# Altium schematic sheet Sheet1.SchDoc
size A4
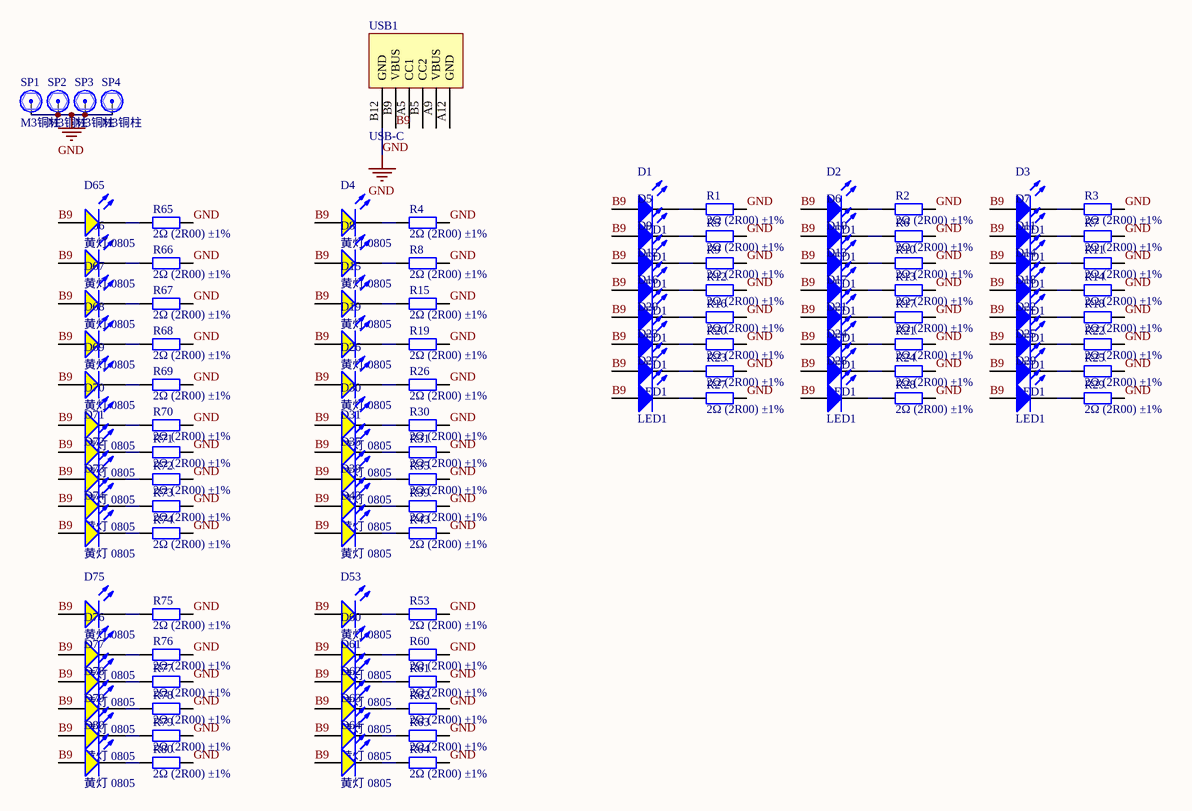
[diagram p0: Sheet1.SchDoc]

## Parts
D1  LED1  [LED-1]
D2  LED1  [LED-1]
D3  LED1  [LED-1]
D4  黄灯 0805  [0805_LED_S1]
D5  LED1  [LED-1]
D6  LED1  [LED-1]
D7  LED1  [LED-1]
D8  黄灯 0805  [0805_LED_S1]
D9  LED1  [LED-1]
D10  LED1  [LED-1]
D11  LED1  [LED-1]
D12  LED1  [LED-1]
D13  LED1  [LED-1]
D14  LED1  [LED-1]
D15  黄灯 0805  [0805_LED_S1]
D16  LED1  [LED-1]
D17  LED1  [LED-1]
D18  LED1  [LED-1]
D19  黄灯 0805  [0805_LED_S1]
D20  LED1  [LED-1]
D21  LED1  [LED-1]
D22  LED1  [LED-1]
D23  LED1  [LED-1]
D24  LED1  [LED-1]
D25  LED1  [LED-1]
D26  黄灯 0805  [0805_LED_S1]
D27  LED1  [LED-1]
D28  LED1  [LED-1]
D29  LED1  [LED-1]
D30  黄灯 0805  [0805_LED_S1]
D31  黄灯 0805  [0805_LED_S1]
D35  黄灯 0805  [0805_LED_S1]
D39  黄灯 0805  [0805_LED_S1]
D43  黄灯 0805  [0805_LED_S1]
D53  黄灯 0805  [0805_LED_S1]
D60  黄灯 0805  [0805_LED_S1]
D61  黄灯 0805  [0805_LED_S1]
D62  黄灯 0805  [0805_LED_S1]
D63  黄灯 0805  [0805_LED_S1]
D64  黄灯 0805  [0805_LED_S1]
D65  黄灯 0805  [0805_LED_S1]
D66  黄灯 0805  [0805_LED_S1]
D67  黄灯 0805  [0805_LED_S1]
D68  黄灯 0805  [0805_LED_S1]
D69  黄灯 0805  [0805_LED_S1]
D70  黄灯 0805  [0805_LED_S1]
D71  黄灯 0805  [0805_LED_S1]
D72  黄灯 0805  [0805_LED_S1]
D73  黄灯 0805  [0805_LED_S1]
D74  黄灯 0805  [0805_LED_S1]
D75  黄灯 0805  [0805_LED_S1]
D76  黄灯 0805  [0805_LED_S1]
D77  黄灯 0805  [0805_LED_S1]
D78  黄灯 0805  [0805_LED_S1]
D79  黄灯 0805  [0805_LED_S1]
D80  黄灯 0805  [0805_LED_S1]
R1  2Ω (2R00) ±1%  [0805_R]
R2  2Ω (2R00) ±1%  [0805_R]
R3  2Ω (2R00) ±1%  [0805_R]
R4  2Ω (2R00) ±1%  [0805_R]
R5  2Ω (2R00) ±1%  [0805_R]
R6  2Ω (2R00) ±1%  [0805_R]
R7  2Ω (2R00) ±1%  [0805_R]
R8  2Ω (2R00) ±1%  [0805_R]
R9  2Ω (2R00) ±1%  [0805_R]
R10  2Ω (2R00) ±1%  [0805_R]
R11  2Ω (2R00) ±1%  [0805_R]
R12  2Ω (2R00) ±1%  [0805_R]
R13  2Ω (2R00) ±1%  [0805_R]
R14  2Ω (2R00) ±1%  [0805_R]
R15  2Ω (2R00) ±1%  [0805_R]
R16  2Ω (2R00) ±1%  [0805_R]
R17  2Ω (2R00) ±1%  [0805_R]
R18  2Ω (2R00) ±1%  [0805_R]
R19  2Ω (2R00) ±1%  [0805_R]
R20  2Ω (2R00) ±1%  [0805_R]
R21  2Ω (2R00) ±1%  [0805_R]
R22  2Ω (2R00) ±1%  [0805_R]
R23  2Ω (2R00) ±1%  [0805_R]
R24  2Ω (2R00) ±1%  [0805_R]
R25  2Ω (2R00) ±1%  [0805_R]
R26  2Ω (2R00) ±1%  [0805_R]
R27  2Ω (2R00) ±1%  [0805_R]
R28  2Ω (2R00) ±1%  [0805_R]
R29  2Ω (2R00) ±1%  [0805_R]
R30  2Ω (2R00) ±1%  [0805_R]
R31  2Ω (2R00) ±1%  [0805_R]
R35  2Ω (2R00) ±1%  [0805_R]
R39  2Ω (2R00) ±1%  [0805_R]
R43  2Ω (2R00) ±1%  [0805_R]
R53  2Ω (2R00) ±1%  [0805_R]
R60  2Ω (2R00) ±1%  [0805_R]
R61  2Ω (2R00) ±1%  [0805_R]
R62  2Ω (2R00) ±1%  [0805_R]
R63  2Ω (2R00) ±1%  [0805_R]
R64  2Ω (2R00) ±1%  [0805_R]
R65  2Ω (2R00) ±1%  [0805_R]
R66  2Ω (2R00) ±1%  [0805_R]
R67  2Ω (2R00) ±1%  [0805_R]
R68  2Ω (2R00) ±1%  [0805_R]
R69  2Ω (2R00) ±1%  [0805_R]
R70  2Ω (2R00) ±1%  [0805_R]
R71  2Ω (2R00) ±1%  [0805_R]
R72  2Ω (2R00) ±1%  [0805_R]
R73  2Ω (2R00) ±1%  [0805_R]
R74  2Ω (2R00) ±1%  [0805_R]
R75  2Ω (2R00) ±1%  [0805_R]
R76  2Ω (2R00) ±1%  [0805_R]
R77  2Ω (2R00) ±1%  [0805_R]
R78  2Ω (2R00) ±1%  [0805_R]
R79  2Ω (2R00) ±1%  [0805_R]
R80  2Ω (2R00) ±1%  [0805_R]
SP1  M3铜柱  [M3x4_L]
SP2  M3铜柱  [M3x4_L]
SP3  M3铜柱  [M3x4_L]
SP4  M3铜柱  [M3x4_L]
USB1  USB-C  [USB-C/S_C]

## Nets
GND: R1.2 R2.2 R3.2 R4.2 R5.2 R6.2 R7.2 R8.2 R9.2 R10.2 R11.2 R12.2 R13.2 R14.2 R15.2 R16.2 R17.2 R18.2 R19.2 R20.2 R21.2 R22.2 R23.2 R24.2 R25.2 R26.2 R27.2 R28.2 R29.2 R30.2 R31.2 R35.2 R39.2 R43.2 R53.2 R60.2 R61.2 R62.2 R63.2 R64.2 R65.2 R66.2 R67.2 R68.2 R69.2 R70.2 R71.2 R72.2 R73.2 R74.2 R75.2 R76.2 R77.2 R78.2 R79.2 R80.2 SP1.1 SP2.1 SP3.1 SP4.1 USB1.B12(GND)
B9: D1.1(A) D2.1(A) D3.1(A) D4.A D5.1(A) D6.1(A) D7.1(A) D8.A D9.1(A) D10.1(A) D11.1(A) D12.1(A) D13.1(A) D14.1(A) D15.A D16.1(A) D17.1(A) D18.1(A) D19.A D20.1(A) D21.1(A) D22.1(A) D23.1(A) D24.1(A) D25.1(A) D26.A D27.1(A) D28.1(A) D29.1(A) D30.A D31.A D35.A D39.A D43.A D53.A D60.A D61.A D62.A D63.A D64.A D65.A D66.A D67.A D68.A D69.A D70.A D71.A D72.A D73.A D74.A D75.A D76.A D77.A D78.A D79.A D80.A USB1.B9(VBUS)
NetD1_2: D1.2(K) R1.1
NetD2_2: D2.2(K) R2.1
NetD3_2: D3.2(K) R3.1
NetD4_K: D4.K R4.1
NetD5_2: D5.2(K) R5.1
NetD6_2: D6.2(K) R6.1
NetD7_2: D7.2(K) R7.1
NetD8_K: D8.K R8.1
NetD9_2: D9.2(K) R9.1
NetD10_2: D10.2(K) R10.1
NetD11_2: D11.2(K) R11.1
NetD12_2: D12.2(K) R12.1
NetD13_2: D13.2(K) R13.1
NetD14_2: D14.2(K) R14.1
NetD15_K: D15.K R15.1
NetD16_2: D16.2(K) R16.1
NetD17_2: D17.2(K) R17.1
NetD18_2: D18.2(K) R18.1
NetD19_K: D19.K R19.1
NetD20_2: D20.2(K) R20.1
NetD21_2: D21.2(K) R21.1
NetD22_2: D22.2(K) R22.1
NetD23_2: D23.2(K) R23.1
NetD24_2: D24.2(K) R24.1
NetD25_2: D25.2(K) R25.1
NetD26_K: D26.K R26.1
NetD27_2: D27.2(K) R27.1
NetD28_2: D28.2(K) R28.1
NetD29_2: D29.2(K) R29.1
NetD30_K: D30.K R30.1
NetD31_K: D31.K R31.1
NetD35_K: D35.K R35.1
NetD39_K: D39.K R39.1
NetD43_K: D43.K R43.1
NetD53_K: D53.K R53.1
NetD60_K: D60.K R60.1
NetD61_K: D61.K R61.1
NetD62_K: D62.K R62.1
NetD63_K: D63.K R63.1
NetD64_K: D64.K R64.1
NetD65_K: D65.K R65.1
NetD66_K: D66.K R66.1
NetD67_K: D67.K R67.1
NetD68_K: D68.K R68.1
NetD69_K: D69.K R69.1
NetD70_K: D70.K R70.1
NetD71_K: D71.K R71.1
NetD72_K: D72.K R72.1
NetD73_K: D73.K R73.1
NetD74_K: D74.K R74.1
NetD75_K: D75.K R75.1
NetD76_K: D76.K R76.1
NetD77_K: D77.K R77.1
NetD78_K: D78.K R78.1
NetD79_K: D79.K R79.1
NetD80_K: D80.K R80.1

Not connected (* = marked no-connect by the designer): USB1 A5(CC1) A9(VBUS) A12(GND) B5(CC2)

## Library data of the parts
D1-D3 D5-D7 D9-D14 D16-D18 D20-D25 D27-D29 = LED1: Typical RED GaAs LED; Published: 8-Jun-2000; LatestRevisionDate: 08-Jul-2005; LatestRevisionNote: Mech Layer 1 removed.; PackageReference: LED-1; Publisher: Altium Limited; PackageDescription: LED; 2 Leads
D4 D8 D15 D19 D26 D30 D31 D35 D39 D43 D53 D60-D80 = 0805 黄灯: 发光二极管; ComponentLink1Description: 供应商链接; ComponentLink1URL: http://www.szlcsc.com/product/details_2669.html; Package: 0805; Supplier: LC; SuppliersPartNumber: C2296
R1-R31 R35 R39 R43 R53 R60-R80 = 0805 2Ω (2R00) 1%: 贴片电阻; ComponentLink1Description: 供应商链接; ComponentLink1URL: http://www.szlcsc.com/product/details_18294.html; Package: 0805; Supplier: LC; SuppliersPartNumber: C17606
SP1-SP4 = 铜柱小焊盘: 铜柱; BOM名称: 铜柱
USB1 = USB-C_6P/S: USB-C_6P型母接口; BOM名称: USB-C型母接口